# EAGLE design 4D_sampling_head (EAGLE 9.2.2)
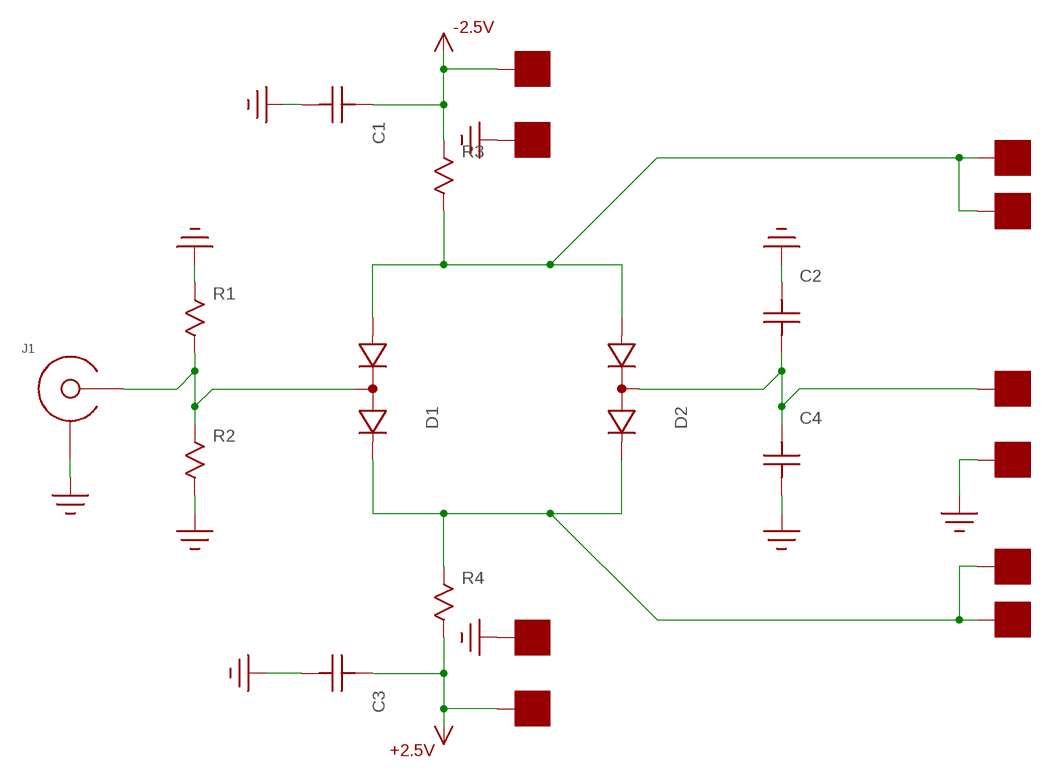
[diagram p0: schematic, sheet 1]

## Parts
C1  C0603  [C0603]
C2  C0603  [C0603]
C3  C0603  [C0603]
C4  C0603  [C0603]
D1  MMBD352LT1G  [SOT-23]
D2  MMBD353LT1G  [SOT-23]
J1  EDGE_LAUNCH_JACK  [EDGE_LAUNCH_RF_CON]
R1  R0603  [R0603]
R2  R0603  [R0603]
R3  R0603  [R0603]
R4  R0603  [R0603]
U$11  PAD50MIL  [PAD_50MIL]
U$12  PAD50MIL  [PAD_50MIL]
U$13  PAD50MIL  [PAD_50MIL]
U$14  PAD50MIL  [PAD_50MIL]
U$15  PAD100MIL  [PAD_100MIL]
U$16  PAD100MIL  [PAD_100MIL]
U$18  PAD100MIL  [PAD_100MIL]
U$19  PAD100MIL  [PAD_100MIL]
U$20  PAD100MIL  [PAD_100MIL]
U$21  PAD100MIL  [PAD_100MIL]

## Nets
+2.5V: C3.P$2 R4.P$2 U$19.P$1
-2.5V: C1.P$2 R3.P$1 U$18.P$1
GND: C1.P$1 C2.P$2 C3.P$1 C4.P$1 J1.GND@1(SHIELD) J1.GND@2(SHIELD) J1.GND@3(SHIELD) J1.GND@4(SHIELD) J1.GND@5(SHIELD) J1.GND@6(SHIELD) J1.GND@7(SHIELD) J1.GND@8(SHIELD) J1.GND@9(SHIELD) J1.GND@10(SHIELD) J1.GND@11(SHIELD) J1.GND@12(SHIELD) J1.SHIELD@1(SHIELD) J1.SHIELD@2(SHIELD) R1.P$1 R2.P$2 U$16.P$1 U$20.P$1 U$21.P$1
N$1: D1.3(COMMON) J1.CENTER R1.P$2 R2.P$1
N$2: D1.2(CATHODE) D2.1(CATHODE) R4.P$1 U$12.P$1 U$14.P$1
N$3: D1.1(ANODE) D2.2(ANODE) R3.P$2 U$11.P$1 U$13.P$1
N$5: C2.P$1 C4.P$2 D2.3(COMMON) U$15.P$1

## Library data of the parts
C1-C4 = yapo:C
D1 = yapo:MMBD352LT1G
D2 = yapo:MMBD353LT1G
J1 = yapo:EDGE_LAUNCH_JACK
R1-R4 = yapo:R
U$11-U$16 U$18-U$21 = yapo:PAD

## Board
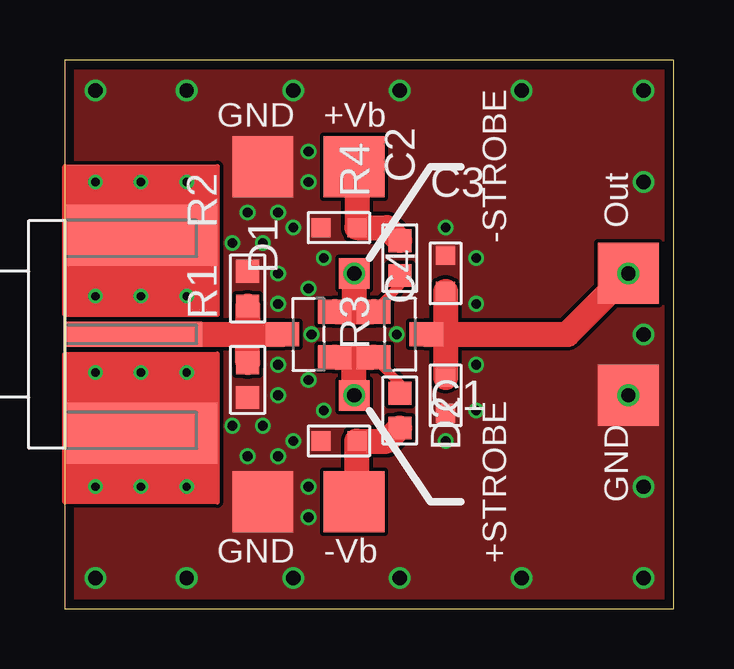
[diagram p1: board, top side]
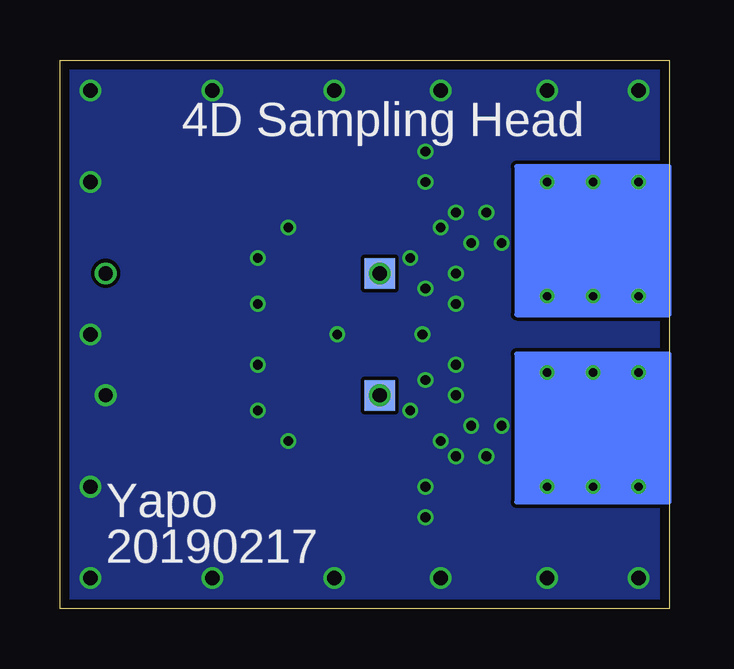
[diagram p2: board, bottom side, seen from below]

Size 25.4 x 22.86 mm. Coordinates in mm from the lower left corner, seen from the top.
Outline: 0,0 25.4,0 25.4,22.86 0,22.86 0,0
Copper layers (1*16): Top 0.035559375mm / dielectric 1.6mm / Bottom 0.035559375mm
Design rules "oshpark-2layer *": minimum track width 6mil, minimum drill 10mil, track to track 6mil, track to pad 6mil, pad to pad 6mil, via to via 6mil, smd to smd 6mil, copper to edge 15mil, drill to drill 6mil, minimum pad ring 5mil, minimum via ring 5mil, stop-mask expansion 2.5mil, vias tented up to drill 30mil, thermal gap 10mil

### Footprints (pad centres in the part's own frame; a part is rotated, then mirrored left to right if it is on the bottom)
C0603 = smd 0.8 x 0.8: P$1 -0.75,0; P$2 0.75,0
SOT-23 = smd 1 x 1.4: 1 -0.95,-1.1; 2 0.95,-1.1; 3 0,1.1
EDGE_LAUNCH_RF_CON = smd 5.715 x 1.041: CENTER -2.875,0 | drill 0.35: GND@1 -5.08,1.587; GND@2 -3.175,1.587; GND@3 -1.27,1.587; GND@4 -5.08,-1.587; GND@5 -3.175,-1.587; GND@6 -1.27,-1.587; GND@7 -5.08,6.35; GND@8 -3.175,6.35; GND@9 -1.27,6.35; GND@10 -5.08,-6.35; GND@11 -3.175,-6.35; GND@12 -1.27,-6.35 | smd 6.35 x 2.54: SHIELD@1 -3.175,-4.128; SHIELD@2 -3.175,4.128
R0603 = smd 0.95 x 0.95: P$1 -0.725,0; P$2 0.725,0
PAD_50MIL = smd 1.27 x 1.27: P$1 0,0
PAD_100MIL = smd 2.54 x 2.54: P$1 0,0

### Placement (x,y rotation side)
C1  11.43,6.99 0 top
C2  15.88,13.97 90 top
C3  11.43,15.88 0 top
C4  15.88,8.89 90 top
D1  10.16,11.43 90 top
D2  13.97,11.43 270 top
J1  0,11.43 180 top
R1  7.62,9.53 90 top
R2  7.62,13.34 90 top
R3  13.97,8.26 90 top
R4  13.97,14.61 90 top
U$11  12.06,8.89 0 top
U$12  12.06,13.97 0 top
U$13  12.06,8.89 0 bottom
U$14  12.06,13.97 0 bottom
U$15  23.5,13.97 0 top
U$16  23.5,8.89 0 top
U$18  12.06,4.45 0 top
U$19  12.06,18.41 0 top
U$20  8.26,18.41 0 top
U$21  8.26,4.45 0 top

### Tracks (layer width: path | path; a pad name or v marks a point on that pad's centre or on a via)
+2.5V
  Top 1.041: R4.P$2 13.43,15.88 C3.P$2 12.18,18.3 U$19.P$1
-2.5V
  Top 1.041: R3.P$1 13.43,6.99 C1.P$2 12.18,4.56 U$18.P$1
GND  (via drill 0.4, 0.6)
  other vias: 1.27,1.27 24.13,1.27 24.13,21.59 1.27,21.59 19.05,21.59 19.05,1.27 13.97,1.27 9.53,1.27 5.08,1.27 5.08,21.59 13.97,21.59 9.53,21.59 24.13,11.43 6.99,15.24 8.26,15.24 6.99,7.62 8.26,7.62 8.89,8.89 8.89,13.97 8.89,12.7 8.89,10.16 10.16,9.53 10.16,13.34 10.16,19.05 10.16,17.78 10.16,5.08 10.16,3.81 7.62,6.35 8.89,6.35 7.62,16.51 8.89,16.51 15.88,15.88 17.14,14.61 17.14,12.7 15.88,6.99 17.14,8.26 17.14,10.16 23.5,8.89 24.13,17.78 24.13,5.08 10.29,11.43 9.53,15.88 10.79,14.61 10.79,8.26 9.53,6.99 13.84,11.43
  pour Top (no thermals): 0,0 25.4,0 25.4,22.86 0,22.86
  pour Bottom (no thermals): 0,0 25.4,0 25.4,22.86 0,22.86
N$1
  Top 1.041: J1.CENTER 7.62,11.43 | 7.62,11.43 D1.3 | R2.P$1 7.62,11.43 | R1.P$2 7.62,11.43
N$2  (via drill 0.6)
  Top 0.406: D2.1 13.97,13.48 R4.P$1
  Top 1.041: D1.2 12.06,12.38 | 12.06,12.38 D2.1 | U$14.P$1 12.06,12.38
  other vias: 12.06,13.97
N$3  (via drill 0.6)
  Top 0.406: D2.2 13.97,9.38 R3.P$2
  Top 1.041: D1.1 12.06,10.48 | 12.06,10.48 D2.2 | U$13.P$1 12.06,10.48
  other vias: 12.06,8.89
N$5  (via drill 0.6)
  Top 1.041: U$15.P$1 20.95,11.43 15.88,11.43 | C2.P$1 15.88,11.43 | 15.88,11.43 C4.P$2 | D2.3 15.88,11.43
  other vias: 23.5,13.97

### Text on the board
tPlace: GND | +Vb | Out | -STROBE | GND | GND | -Vb | +STROBE
bPlace: 4D Sampling Head | Yapo | 20190217